# EAGLE design PS2Encoder_v1 (EAGLE 4.16)
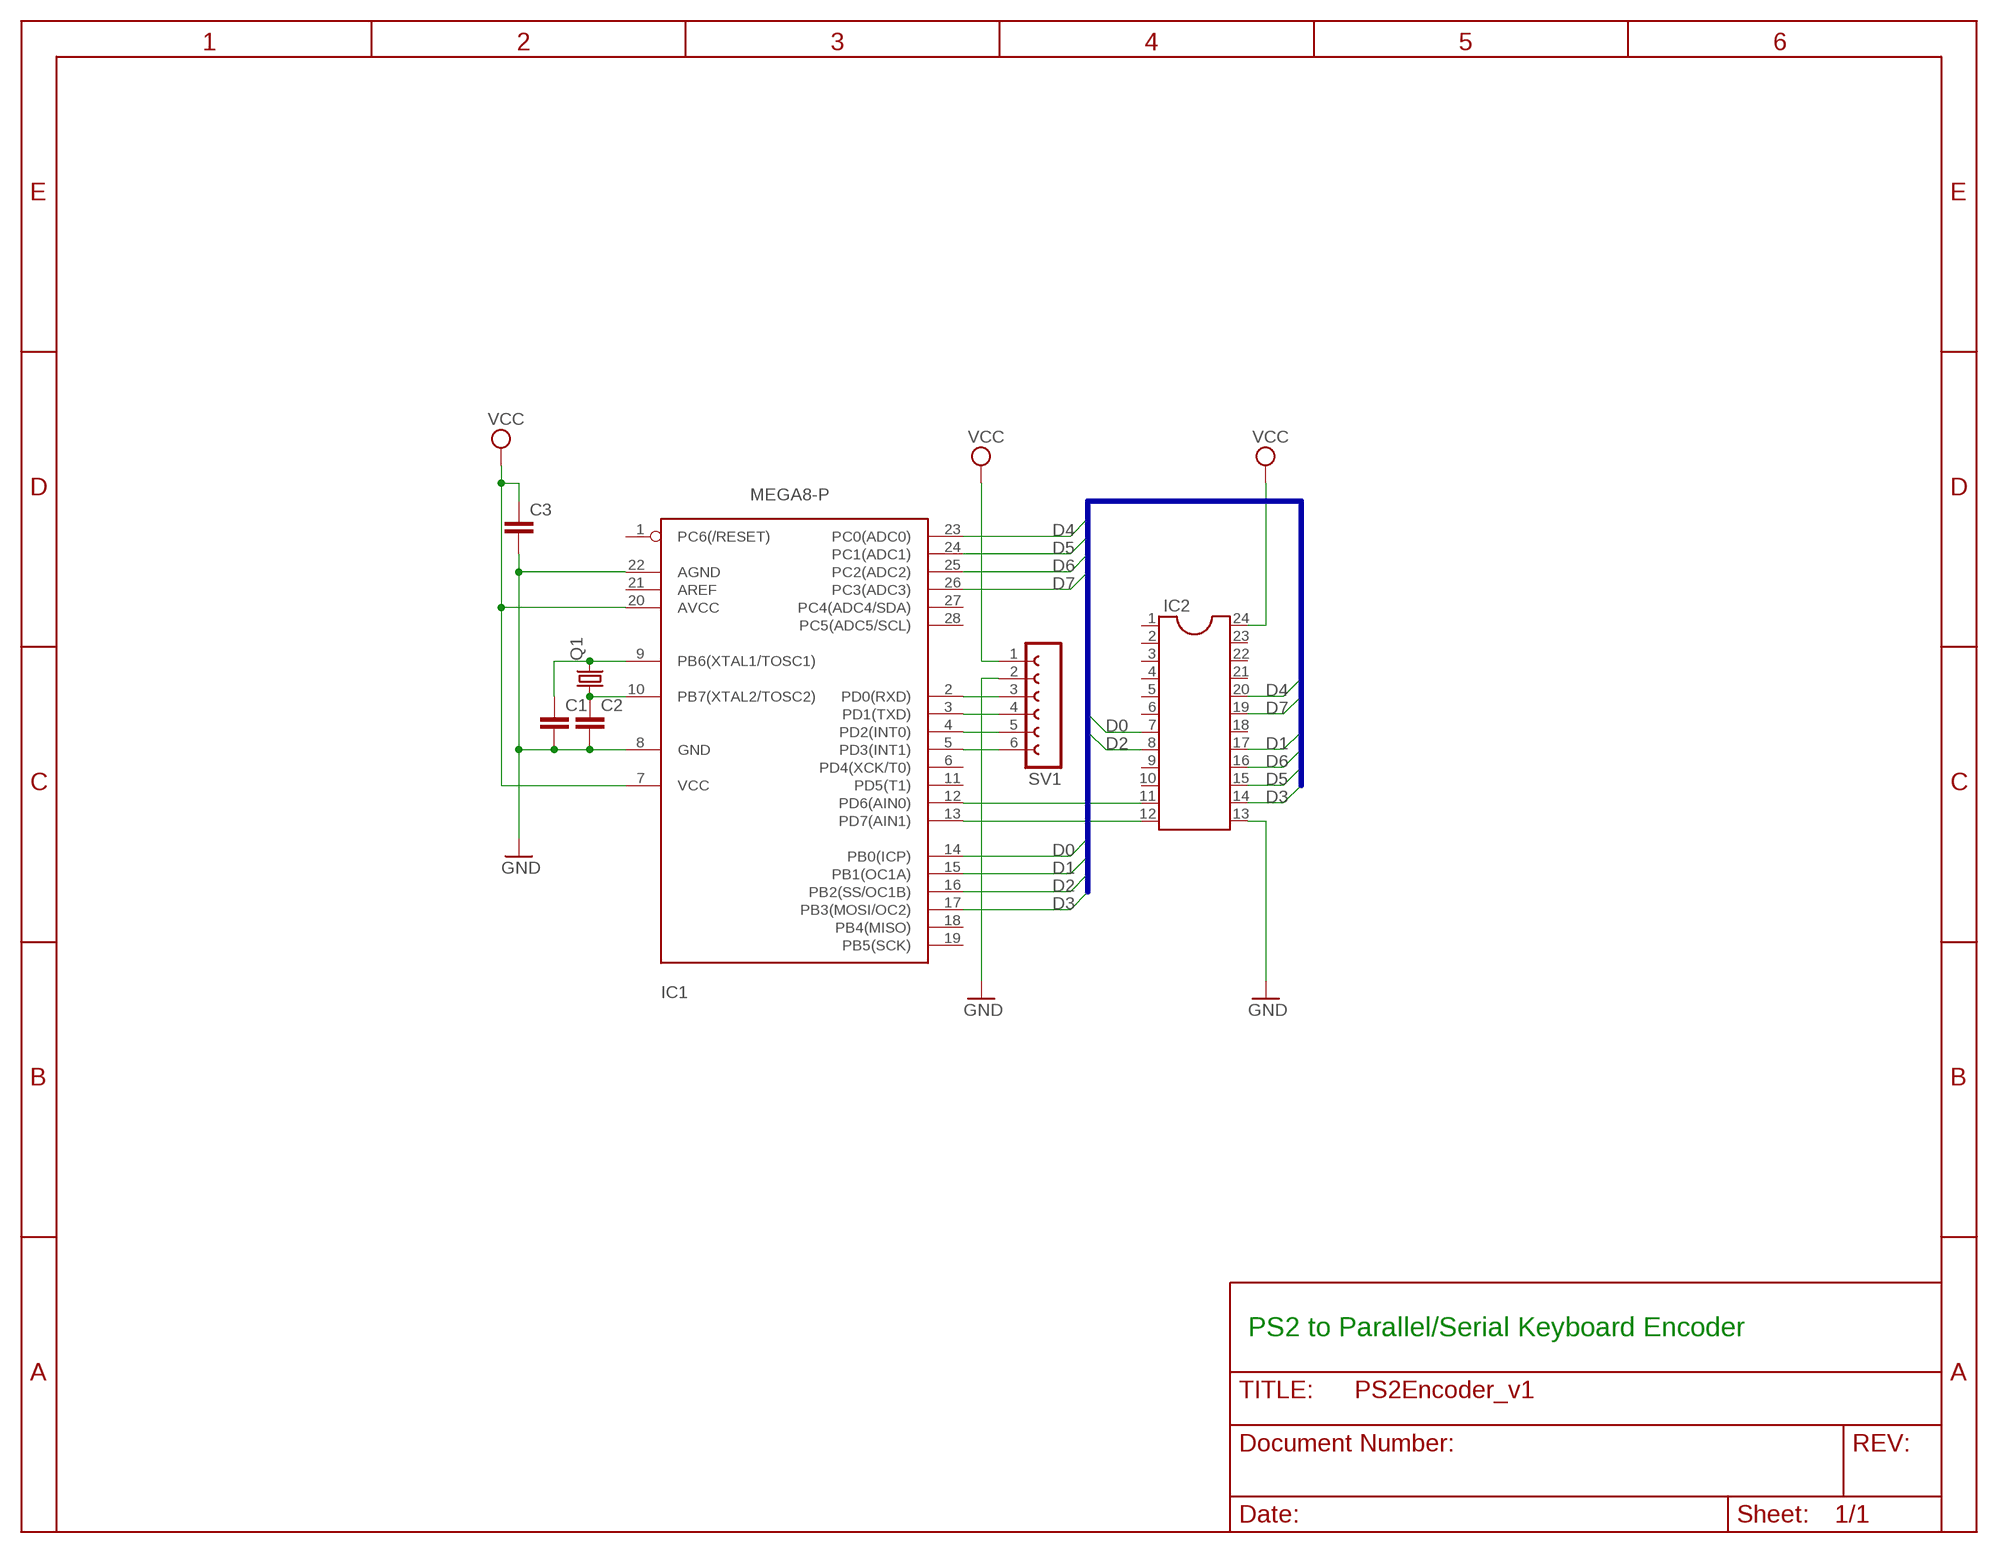
[diagram p0: schematic, sheet 1]

## Parts
C1  C-EU025-024X044  [C025-024X044]
C2  C-EU025-024X044  [C025-024X044]
C3  C-EU025-024X044  [C025-024X044]
IC1  MEGA8-P  [DIL28-3]
IC2  DIL24-6  [DIL24-6]
Q1  CRYSTALHC49U-V  [HC49U-V]
SV1  FE06-1  [FE06]

## Nets
D0: IC1.14(PB0(ICP)) IC2.7
D1: IC1.15(PB1(OC1A)) IC2.17
D2: IC1.16(PB2(SS/OC1B)) IC2.8
D3: IC1.17(PB3(MOSI/OC2)) IC2.14
D4: IC1.23(PC0(ADC0)) IC2.20
D5: IC1.24(PC1(ADC1)) IC2.15
D6: IC1.25(PC2(ADC2)) IC2.16
D7: IC1.26(PC3(ADC3)) IC2.19
GND: C1.2 C2.2 C3.2 IC1.8(GND) IC1.22(AGND) IC2.13 SV1.2
N$1: IC1.12(PD6(AIN0)) IC2.11
N$2: IC1.13(PD7(AIN1)) IC2.12
N$4: C2.1 IC1.10(PB7(XTAL2/TOSC2)) Q1.1
N$5: C1.1 IC1.9(PB6(XTAL1/TOSC1)) Q1.2
N$7: IC1.2(PD0(RXD)) SV1.3
N$8: IC1.3(PD1(TXD)) SV1.4
N$9: IC1.4(PD2(INT0)) SV1.5
N$10: IC1.5(PD3(INT1)) SV1.6
VCC: C3.1 IC1.7(VCC) IC1.20(AVCC) IC2.24 SV1.1
Unconnected: IC1.1(PC6(/RESET)) IC1.6(PD4(XCK/T0)) IC1.11(PD5(T1)) IC1.18(PB4(MISO)) IC1.19(PB5(SCK)) IC1.21(AREF) IC1.27(PC4(ADC4/SDA)) IC1.28(PC5(ADC5/SCL)) IC2.1 IC2.2 IC2.3 IC2.4 IC2.5 IC2.6 IC2.9 IC2.10 IC2.18 IC2.21 IC2.22 IC2.23

## Buses
D[0..7]

## Notes on the sheet
- PS2 to Parallel/Serial Keyboard Encoder

## Library data of the parts
C1-C3 = rcl:C-EU: CAPACITOR, European symbol
IC1 = atmel:MEGA8-P: MICROCONTROLLER 8 Kbytes FLASH 1 kbytes SRAM 512 bytes EEPROM USART 4-channel 10 bit ADC 2-channel 8 bit ADC Source: avr.lbr
IC2 = ic-package:DIL24: Dual In Line
Q1 = crystal:CRYSTAL: CRYSTAL
SV1 = con-lsta:FE06-1: FEMALE HEADER

## Board
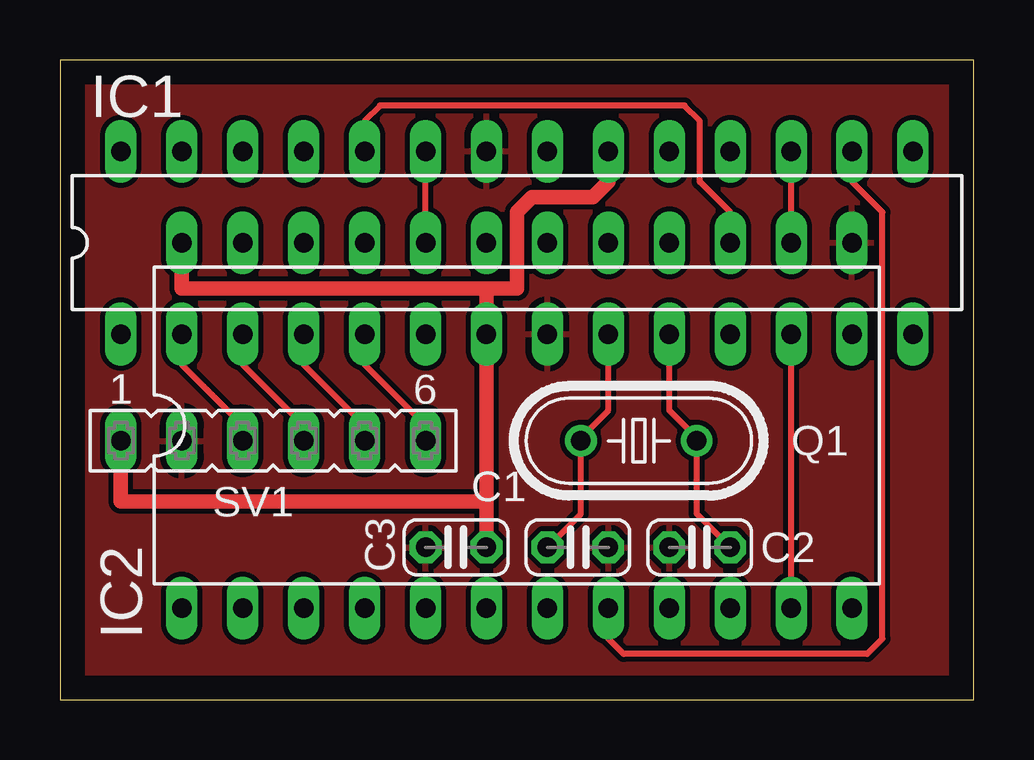
[diagram p1: board, top side]
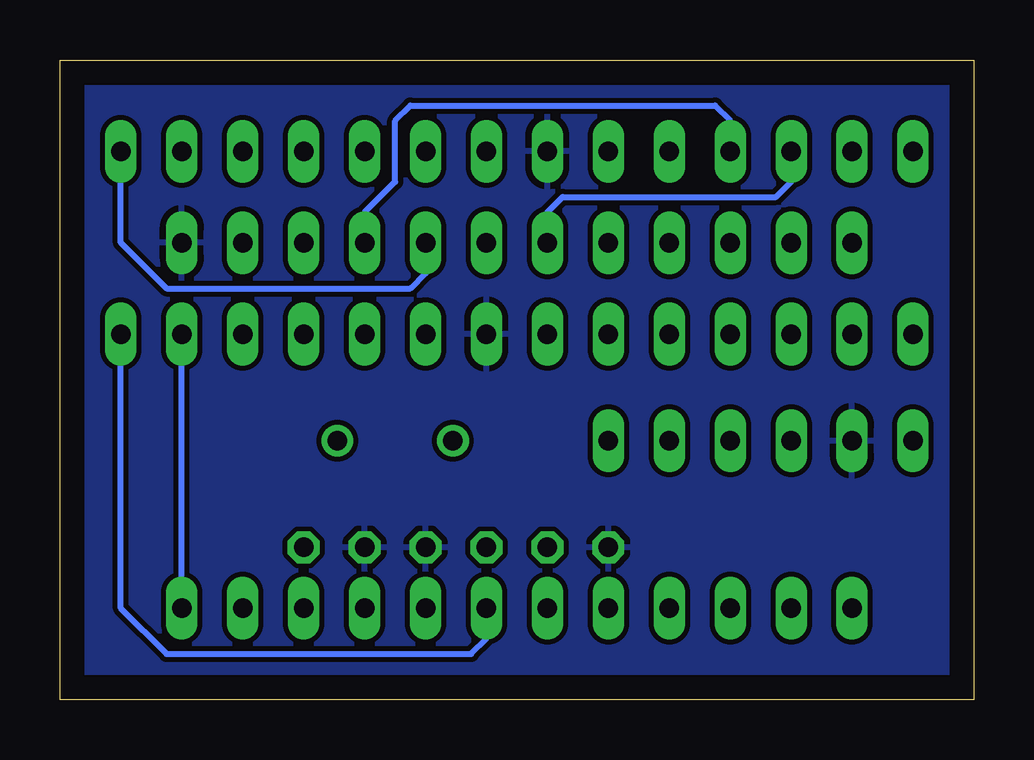
[diagram p2: board, bottom side, seen from below]

Size 38.1 x 26.67 mm. Coordinates in mm from the lower left corner, seen from the top.
Outline: 38.1,0 38.1,26.67 0,26.67 0,0 38.1,0
Copper layers (1*16): Top 0.035mm / dielectric 1.5mm / Bottom 0.035mm
Design rules "default": minimum track width 10mil, minimum drill 24mil, track to track 8mil, track to pad 8mil, pad to pad 8mil, via to via 8mil, smd to smd 8mil, copper to edge 40mil, drill to drill 8mil, minimum pad ring 10mil, minimum via ring 8mil, stop-mask expansion 4mil, vias tented up to drill 0mil, thermal gap 10mil

### Footprints (pad centres in the part's own frame; a part is rotated, then mirrored left to right if it is on the bottom)
C025-024X044 = drill 0.813 octagon: 1 -1.27,0; 2 1.27,0
DIL28-3 = drill 0.813 long: 1 -16.51,-3.81; 2 -13.97,-3.81; 3 -11.43,-3.81; 4 -8.89,-3.81; 5 -6.35,-3.81; 6 -3.81,-3.81; 7 -1.27,-3.81; 8 1.27,-3.81; 9 3.81,-3.81; 10 6.35,-3.81; 11 8.89,-3.81; 12 11.43,-3.81; 13 13.97,-3.81; 14 16.51,-3.81; 15 16.51,3.81; 16 13.97,3.81; 17 11.43,3.81; 18 8.89,3.81; 19 6.35,3.81; 20 3.81,3.81; 21 1.27,3.81; 22 -1.27,3.81; 23 -3.81,3.81; 24 -6.35,3.81; 25 -8.89,3.81; 26 -11.43,3.81; 27 -13.97,3.81; 28 -16.51,3.81
DIL24-6 = drill 0.813 long: 1 -13.97,-7.62; 2 -11.43,-7.62; 3 -8.89,-7.62; 4 -6.35,-7.62; 5 -3.81,-7.62; 6 -1.27,-7.62; 7 1.27,-7.62; 8 3.81,-7.62; 9 6.35,-7.62; 10 8.89,-7.62; 11 11.43,-7.62; 12 13.97,-7.62; 13 13.97,7.62; 14 11.43,7.62; 15 8.89,7.62; 16 6.35,7.62; 17 3.81,7.62; 18 1.27,7.62; 19 -1.27,7.62; 20 -3.81,7.62; 21 -6.35,7.62; 22 -8.89,7.62; 23 -11.43,7.62; 24 -13.97,7.62
HC49U-V = drill 0.813 round: 1 -2.413,0; 2 2.413,0
FE06 = drill 0.813 long: 1 -6.35,0; 2 -3.81,0; 3 -1.27,0; 4 1.27,0; 5 3.81,0; 6 6.35,0

### Placement (x,y rotation side)
C1  21.59,6.35 0 top
C2  26.67,6.35 180 top
C3  16.51,6.35 180 top
IC1  19.05,19.05 0 top
IC2  19.05,11.43 0 top
Q1  24.13,10.79 180 top
SV1  8.89,10.79 0 top

### Tracks (layer width: path | path; a pad name or v marks a point on that pad's centre or on a via)
D0
  Bottom 0.254: IC2.7 20.32,2.54 20.95,1.91 33.66,1.91 35.56,3.81 IC1.14
D1
  Bottom 0.254: IC2.17 22.86,17.78 23.5,17.14 33.66,17.14 35.56,19.05 IC1.15
D2
  Top 0.254: IC2.8 22.86,2.54 23.5,1.91 33.66,1.91 34.29,2.54 34.29,20.32 33.02,21.59 IC1.16
D3
  Top 0.254: IC2.14 IC1.17
D4
  Top 0.254: IC2.20 IC1.23
D5
  Top 0.254: IC1.24 12.7,24.13 13.34,24.77 26.04,24.77 26.67,24.13 26.67,21.59 27.94,20.32 IC2.15
D6
  Bottom 0.254: IC1.25 10.16,24.13 10.79,24.77 23.5,24.77 24.13,24.13 24.13,21.59 25.4,20.32 IC2.16
D7
  Bottom 0.254: IC1.26 7.62,21.59 8.26,20.95 17.14,20.95 17.78,20.32 IC2.19
GND
  pour Bottom: 0,0 38.1,0 38.1,26.67 0,26.67
  pour Top: 0,0 38.1,0 38.1,26.67 0,26.67
N$1
  Top 0.254: IC2.11 IC1.12
N$2
  Bottom 0.254: IC2.12 IC1.13
N$4
  Top 0.254: IC1.10 25.4,12.06 26.67,10.79 Q1.1 26.54,7.75 C2.1
N$5
  Top 0.254: IC1.9 22.86,12.06 21.59,10.79 Q1.2 21.72,7.75 C1.1
N$7
  Top 0.254: SV1.3 7.62,11.43 5.08,13.97 IC1.2
N$8
  Top 0.254: SV1.4 10.16,11.43 7.62,13.97 IC1.3
N$9
  Top 0.254: SV1.5 12.7,11.43 10.16,13.97 IC1.4
N$10
  Top 0.254: SV1.6 15.24,11.43 12.7,13.97 IC1.5
VCC
  Top 0.61: 19.05,17.14 17.78,17.14 IC1.7 17.78,8.26 | 19.05,17.14 19.05,20.32 19.68,20.95 22.23,20.95 22.86,21.59 IC1.20 | C3.1 17.78,8.26 | IC2.24 5.08,17.14 19.05,17.14 | SV1.1 2.54,8.26 17.78,8.26